# Altium schematic sheet Driver_Filter.schdoc: FMC DAC 1.5GS 4CH
size 420 x 297 mm; EDA_Number: ARTIQ; Projet: ARTIQ/SINARA; Author: G.Kasprowicz; CompanyName: WUT ISE; DrawnBy: G.Kasprowicz; Organization: WUT ISE; Address1: PW ISE; Address2: Nowowiejska 15/19 00-665 Warsaw; Address3: gkasprow@gmail.com; DocumentNumber: 1; Revision: 1; SheetNumber: 1; SheetTotal: 18; ModifiedBy: -; CheckedDate: -; Title2: Top; DivGrp: WUT ISE; Designer: G.Kasprowicz; ModifiedDate: -; ProjectName: Sensor Box
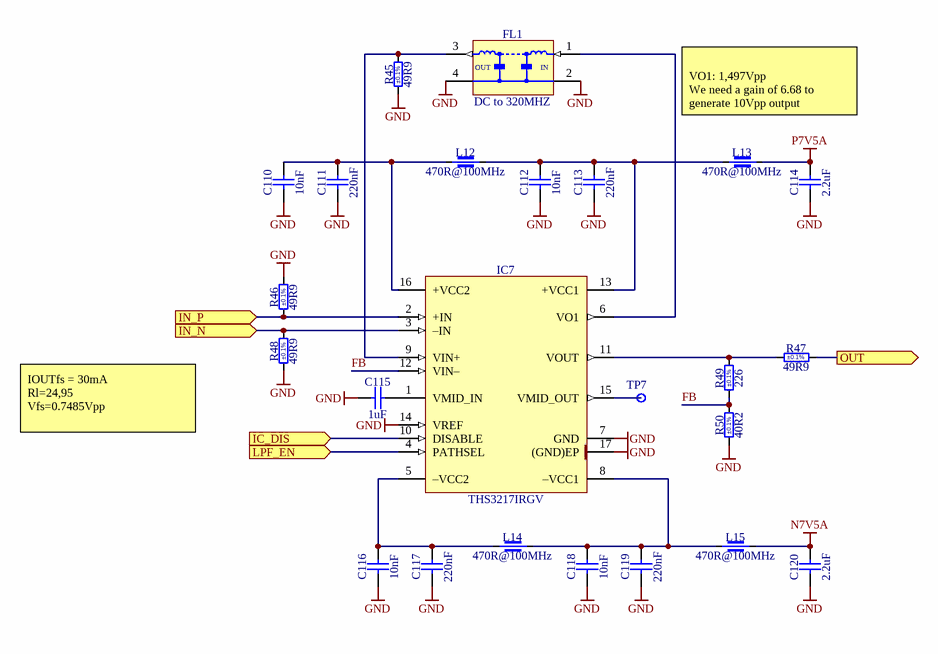
[diagram p0: Driver_Filter.schdoc]

## Parts
C110  10nF  [CAPC1005X55N]
C111  220nF  [CAPC1005X55N]
C112  10nF  [CAPC1005X55N]
C113  220nF  [CAPC1005X55N]
C114  2.2uF  [CAPC1005X55N]
C115  1uF  [CAPC1005X55N]
C116  10nF  [CAPC1005X55N]
C117  220nF  [CAPC1005X55N]
C118  10nF  [CAPC1005X55N]
C119  220nF  [CAPC1005X55N]
C120  2.2uF  [CAPC1005X55N]
FL1  DC to 320MHZ  [FIL_MINI-CIRCUITS_FV1206]
IC7  THS3217IRGV  [QFN65P400X400X100-17N-S225]
L12  470R@100MHz  [INDC1608X95N]
L13  470R@100MHz  [INDC1608X95N]
L14  470R@100MHz  [INDC1608X95N]
L15  470R@100MHz  [INDC1608X95N]
R45  49R9  Tolerance: ±0.1%  [RESC1608X55N]
R46  49R9  Tolerance: ±0.1%  [RESC1608X55N]
R47  49R9  Tolerance: ±0.1%  [RESC1608X55N]
R48  49R9  Tolerance: ±0.1%  [RESC1608X55N]
R49  226  Tolerance: ±0.1%  [RESC1608X55N]
R50  40R2  Tolerance: ±0.1%  [RESC1608X55N]
TP7  Test Point  [TPS127]  (value not drawn)  (no BOM)

## Ports
IC_DIS (in), IN_N (in), IN_P (in), LPF_EN (in), OUT (out)

## Nets
GND: C110.1 C111.1 C112.1 C113.1 C114.1 C115.1 C116.1 C117.1 C118.1 C119.1 C120.1 FL1.2(GND) FL1.4(GND) IC7.7(GND) IC7.14(VREF) IC7.17((GND)EP) R45.1 R46.2 R48.1 R50.1
N7V5A: C120.2 L15.2
P7V5A: C114.2 L13.2
FB: IC7.12(VIN–) R49.1 R50.2
IC_DIS: IC7.10(DISABLE) ; port IC_DIS
IN_N: IC7.3(–IN) R48.2 ; port IN_N
IN_P: IC7.2(+IN) R46.1 ; port IN_P
LPF_EN: IC7.4(PATHSEL) ; port LPF_EN
OUT: R47.2 ; port OUT
NetC110_2: C110.2 C111.2 IC7.16(+VCC2) L12.1
NetC112_2: C112.2 C113.2 IC7.13(+VCC1) L12.2 L13.1
NetC115_2: C115.2 IC7.1(VMID_IN)
NetC116_2: C116.2 C117.2 IC7.5(–VCC2) L14.1
NetC118_2: C118.2 C119.2 IC7.8(–VCC1) L14.2 L15.1
NetFL1_1: FL1.1(RFIN) IC7.6(VO1)
NetFL1_3: FL1.3(RFOUT) IC7.9(VIN+) R45.2
NetIC7_11: IC7.11(VOUT) R47.1 R49.2
NetIC7_15: IC7.15(VMID_OUT) TP7.1

## Notes on the sheet
- VO1: 1,497Vpp
  We need a gain of 6.68 to generate 10Vpp output
- IOUTfs = 30mA
  Rl=24,95
  Vfs=0.7485Vpp
- Project/Equipment
- Document
- Designer
- Drawn by
- Check.by
- Copyright WUT ISE 2018.
  This documentation describes Open Hardware and is licensed under the CERN OHL v.1.1. You may redistribute and modify this documentation under the terms of the CERN OHL v.1.1. (http://ohwr.org/CERNOHL). This documentation is distributed WITHOUT ANY EXPRESS OR IMPLIED WARRANTY, INCLUDING OF MERCHANTABILITY, SATISFACTORY QUALITY AND FITNESS FOR A PARTICULAR PURPOSE. Please see the CERN OHL v.1.1 for applicable conditions.
- Contact
- File
- Last Mod.
- Print Date
- Sheet
- Size
- A3
- of
- Rev
- (in symbol FIL_MINI-CIRCUITS_LFCN-320+) OUT; IN

## Library data of the parts
C110 C112 C116 C118 = CC0402_10NF_16V_10%_X7R: Non-polarised capacitor; Part Description: SMD Multilayer Chip Ceramic Capacitor; Manufacturer: GENERIC; Manufacturer1 Part Number: 223878715636; Voltage: 16V; TC: X7R; Tolerance: ±10%; Part Number: CC0402_10NF_16V_10%_X7R; Component Kind: Standard; Component Type: Standard; Pin Count: 2; Value: 10nF; Status: Not Recommended; Manufacturer Part Number: CC0402_10NF_16V_10%_X7R; Case: 0402; Mounted: Yes; Socket: No; SMD: Yes; Sense: No; Manufacturer1 Example: PHYCOMP; Manufacturer1 ComponentHeight: 0.55mm; HelpURL: \\cern.ch\dfs\Applications\Altium\Datasheets\CC0402_X7R_PHYCOMP.pdf; Author: CERN DEM JLC; CreateDate: 03.12.2007; LatestRevisionDate: 03.12.2007
C111 C113 C117 C119 = CC0402_220NF_16V_10%_X7R: Non-polarised capacitor; Part Description: SMD Multilayer Chip Ceramic Capacitor; Manufacturer: GENERIC; Manufacturer1 Part Number: C1005X7R1C224K050; Voltage: 16V; TC: X7R; Tolerance: ±10%; Part Number: CC0402_220NF_16V_10%_X7R; Component Kind: Standard; Component Type: Standard; Pin Count: 2; Value: 220nF; Status: Preferred; Manufacturer Part Number: CC0402_220NF_16V_10%_X7R; Case: 0402; Mounted: Yes; Socket: No; SMD: Yes; Sense: No; Manufacturer1 Example: TDK; Manufacturer1 ComponentHeight: 0.55mm; HelpURL: \\cern.ch\dfs\Applications\Altium\Datasheets\CC0402_X7R_TDK_C.pdf; Author: CERN DEM JLC; CreateDate: 25.10.2012; LatestRevisionDate: 25.10.2012
C114 C120 = CC0402_2.2UF_16V_10%_X5R: Non-polarised capacitor; Part Description: SMD Multilayer Chip Ceramic Capacitor; Manufacturer: GENERIC; Manufacturer1 Part Number: C1005X5R1C225K050BC; Voltage: 16V; TC: X5R; Tolerance: ±10%; Part Number: CC0402_2.2UF_16V_10%_X5R; Component Kind: Standard; Component Type: Standard; Pin Count: 2; Value: 2.2uF; Status: Preferred; Manufacturer Part Number: CC0402_2.2UF_16V_10%_X5R; Case: 0402; Mounted: Yes; Socket: No; SMD: Yes; Sense: No; Manufacturer1 Example: TDK; Manufacturer1 ComponentHeight: 0.55mm; HelpURL: \\cern.ch\dfs\Applications\Altium\Datasheets\CC0402_X5R_TDK_C.pdf; Author: CERN DEM BC; CreateDate: 08.02.2021; LatestRevisionDate: 08.02.2021
C115 = CC0402_1UF_16V_10%_X5R: Non-polarised capacitor; Part Description: SMD Multilayer Chip Ceramic Capacitor; Manufacturer: GENERIC; Manufacturer1 Part Number: C1005X5R1C105KT; Voltage: 16V; TC: X5R; Tolerance: ±10%; Part Number: CC0402_1UF_16V_10%_X5R; Component Kind: Standard; Component Type: Standard; Pin Count: 2; Value: 1uF; Status: Preferred; Manufacturer Part Number: CC0402_1UF_16V_10%_X5R; Case: 0402; Mounted: Yes; Socket: No; SMD: Yes; Sense: No; Manufacturer1 Example: TDK; Manufacturer1 ComponentHeight: 0.55mm; HelpURL: \\cern.ch\dfs\Applications\Altium\Datasheets\CC0402_X5R_TDK_C.pdf; Author: CERN DEM JLC; CreateDate: 25.10.2012; LatestRevisionDate: 25.10.2012
FL1 = FIL_MINI-CIRCUITS_LFCN-320+: 50 Ohm Low Pass Filter; Part Number: FIL_MINI-CIRCUITS_LFCN-320+; Component Kind: Standard; Component Type: Standard; Pin Count: 4; Value: DC to 320MHZ; Part Description: 50 Ohm Low Pass Filter; Manufacturer: MINI-CIRCUITS; Manufacturer Part Number: LFCN-320+; Mounted: Yes; Socket: No; SMD: Yes; Sense: No; ComponentHeight: 0.94mm; HelpURL: \\cern.ch\dfs\Applications\Altium\Datasheets\FIL_MINI-CIRCUITS_LFCN-320+.pdf; Author: CERN DEM MR; CreateDate: 29.09.2017; LatestRevisionDate: 29.09.2017
IC7 = THS3217IRGV: DC to 800-MHz, Differential-to-Single-Ended, DAC Output Amplifier; Manufacturer: TEXAS INSTRUMENTS; PressFit: No; Bonding: No; Part Number: THS3217IRGV; Component Kind: Standard; Component Type: Standard; Device: THS3217IRGV; PackageDescription: QFN, 0.65mm Pitch; Square; 16 Pin, 4.00mm L X 4.00mm W X 1.00mm H body (w/Thermal Tab 2.25 X 2.25mm), IPC Medium Density; Part Description: DC to 800-MHz, Differential-to-Single-Ended, DAC Output Amplifier; Manufacturer Part Number: THS3217IRGV; Pin Count: 17; Case: QFN16; Mounted: Yes; Socket: No; SMD: Yes; Sense: No; ComponentHeight: 1mm; Author: CERN DEM HF; HelpURL: \\cern.ch\dfs\Applications\Altium\Datasheets\THS3217.pdf; CreateDate: 22.10.2021; LatestRevisionDate: 22.10.2021
L12-L15 = IND0603_MURATA_BLM18PG471SN1D: Part Description: SMD EMIFIL Chip Ferrite Bead; Manufacturer: MURATA; Power: 1A; Resistance: 0.2R; Tolerance: ±25%; Part Number: IND0603_MURATA_BLM18PG471SN1D; Component Kind: Standard; Component Type: Standard; Pin Count: 2; Value: 470R@100MHz; Manufacturer Part Number: BLM18PG471SN1D; Case: 0603; Mounted: Yes; Socket: No; SMD: Yes; Sense: No; ComponentHeight: 0.95mm; HelpURL: \\cern.ch\dfs\Applications\Altium\Datasheets\IND0603_MURATA_BLM18P.pdf; Author: CERN DEM BC; CreateDate: 17.02.2021; LatestRevisionDate: 17.02.2021
R45-R48 = R0603_49R9_0.1%_0.063W_10PPM: Resistor - 0.1%; Part Description: Thin Film Chip Resistor; Manufacturer: GENERIC; Manufacturer1 Part Number: RN73C1J49R9BTDF; Power: 0.063W; TC: ±10ppm; PressFit: No; Part Number: R0603_49R9_0.1%_0.063W_10PPM; Component Kind: Standard; Component Type: Standard; Pin Count: 2; Value: 49R9; Status: Not Recommended; Manufacturer Part Number: R0603_49R9_0.1%_0.063W_10PPM; Case: 0603; Mounted: Yes; Sense: No; Socket: No; SMD: Yes; Manufacturer1 Example: TYCO HOLSWORTHY; Manufacturer1 ComponentHeight: 0.5mm; HelpURL: \\cern.ch\dfs\Applications\Altium\Datasheets\R0603_Tyco_RN73.pdf; Author: CERN DEM JLC; CreateDate: 03.12.2007; LatestRevisionDate: 13.03.2008
R49 = R0603_226R_0.1%_0.063W_10PPM: Resistor - 0.1%; Part Description: Thin Film Chip Resistor; Manufacturer: GENERIC; Manufacturer1 Part Number: RN73C1J226RBTDF; Power: 0.063W; TC: ±10ppm; PressFit: No; Part Number: R0603_226R_0.1%_0.063W_10PPM; Component Kind: Standard; Component Type: Standard; Pin Count: 2; Value: 226; Status: Not Recommended; Manufacturer Part Number: R0603_226R_0.1%_0.063W_10PPM; Case: 0603; Mounted: Yes; Sense: No; Socket: No; SMD: Yes; Manufacturer1 Example: TYCO HOLSWORTHY; Manufacturer1 ComponentHeight: 0.5mm; HelpURL: \\cern.ch\dfs\Applications\Altium\Datasheets\R0603_Tyco_RN73.pdf; Author: CERN DEM JLC; CreateDate: 03.12.2007; LatestRevisionDate: 13.03.2008
R50 = R0603_40R2_0.1%_0.063W_10PPM: Resistor - 0.1%; Part Description: Thin Film Chip Resistor; Manufacturer: GENERIC; Manufacturer1 Part Number: RN73C1J40R2BTDF; Power: 0.063W; TC: ±10ppm; PressFit: No; Part Number: R0603_40R2_0.1%_0.063W_10PPM; Component Kind: Standard; Component Type: Standard; Pin Count: 2; Value: 40R2; Status: Not Recommended; Manufacturer Part Number: R0603_40R2_0.1%_0.063W_10PPM; Case: 0603; Mounted: Yes; Sense: No; Socket: No; SMD: Yes; Manufacturer1 Example: TYCO HOLSWORTHY; Manufacturer1 ComponentHeight: 0.5mm; HelpURL: \\cern.ch\dfs\Applications\Altium\Datasheets\R0603_Tyco_RN73.pdf; Author: CERN DEM JLC; CreateDate: 03.12.2007; LatestRevisionDate: 13.03.2008
TP7 = SMD_PAD_1.27X1.27MM: Part Description: 1.27mm x 1.27mm PCB Copper Area (SMD Test Point); Mounted: No; Part Number: SMD_PAD_1.27X1.27MM; Component Type: Standard (No BOM); Pin Count: 1; Family: Test Point; Socket: No; SMD: No; Sense: No; Status: None; ComponentHeight: 0mm; HelpURL: Undefined; Author: CERN DEM JLC; CreateDate: 12.01.2008; LatestRevisionDate: 12.01.2008; PackageDescription: 1.27mm x 1.27mm PCB Copper Area (SMD Test Point)